# EAGLE schematic rotary_breakout (EAGLE 9.2.0)
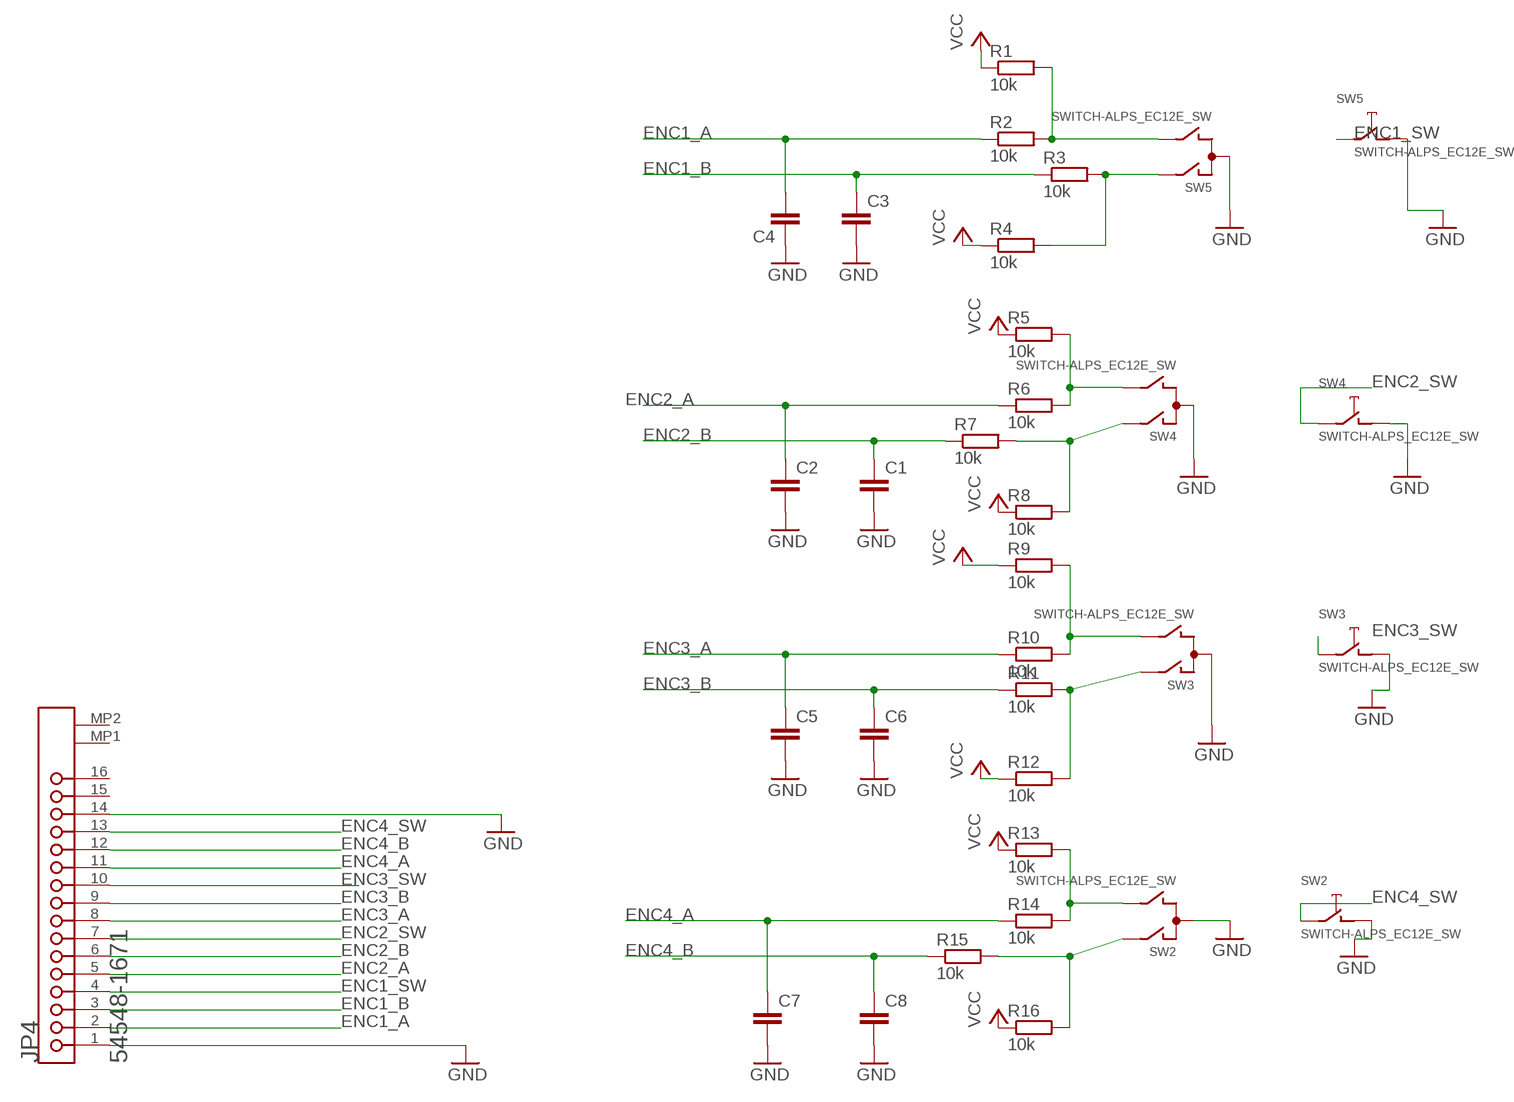
[diagram p0: schematic, sheet 1]

## Parts
C1  C-EUC0805  [C0805]
C2  C-EUC0805  [C0805]
C3  C-EUC0805  [C0805]
C4  C-EUC0805  [C0805]
C5  C-EUC0805  [C0805]
C6  C-EUC0805  [C0805]
C7  C-EUC0805  [C0805]
C8  C-EUC0805  [C0805]
JP4  MOLEX_54548-1671MOLEX_54548-1671_0_0  [MOLEX_54548-1671_0]
R1  10k  R-EU_R0603  [R0603]
R2  10k  R-EU_R0603  [R0603]
R3  10k  R-EU_R0603  [R0603]
R4  10k  R-EU_R0603  [R0603]
R5  10k  R-EU_R0603  [R0603]
R6  10k  R-EU_R0603  [R0603]
R7  10k  R-EU_R0603  [R0603]
R8  10k  R-EU_R0603  [R0603]
R9  10k  R-EU_R0603  [R0603]
R10  10k  R-EU_R0603  [R0603]
R11  10k  R-EU_R0603  [R0603]
R12  10k  R-EU_R0603  [R0603]
R13  10k  R-EU_R0603  [R0603]
R14  10k  R-EU_R0603  [R0603]
R15  10k  R-EU_R0603  [R0603]
R16  10k  R-EU_R0603  [R0603]
SW2  SWITCH-ALPS_EC12E_SW  [SWITCH-ALPS_ALPS_EC12E_SW]
SW3  SWITCH-ALPS_EC12E_SW  [SWITCH-ALPS_ALPS_EC12E_SW]
SW4  SWITCH-ALPS_EC12E_SW  [SWITCH-ALPS_ALPS_EC12E_SW]
SW5  SWITCH-ALPS_EC12E_SW  [SWITCH-ALPS_ALPS_EC12E_SW]

## Nets
ENC1_A: C4.2 JP4.2 R2.1
ENC1_B: C3.1 JP4.3 R3.1
ENC1_SW: JP4.4 SW5.E
ENC2_A: C2.1 JP4.5 R6.1
ENC2_B: C1.1 JP4.6 R7.1
ENC2_SW: JP4.7 SW4.E
ENC3_A: C5.1 JP4.8 R10.1
ENC3_B: C6.1 JP4.9 R11.1
ENC3_SW: JP4.10 SW3.E
ENC4_A: C7.1 JP4.11 R14.1
ENC4_B: C8.1 JP4.12 R15.1
ENC4_SW: JP4.13 SW2.E
GND: C1.2 C2.2 C3.2 C4.1 C5.2 C6.2 C7.2 C8.2 JP4.1 JP4.14 SW2.C SW2.D SW3.C SW3.D SW4.C SW4.D SW5.C SW5.D
N$1: R1.2 R2.2 SW5.B
N$2: R5.2 R6.2 SW4.B
N$3: R9.2 R10.2 SW3.B
N$4: R13.2 R14.2 SW2.B
N$5: R7.2 R8.2 SW4.A
N$6: R11.2 R12.2 SW3.A
N$7: R15.2 R16.2 SW2.A
N$8: R3.2 R4.2 SW5.A
VCC: R1.1 R4.1 R5.1 R8.1 R9.1 R12.1 R13.1 R16.1
Unconnected: JP4.15 JP4.16 JP4.MP1 JP4.MP2 SW2.GND1(G) SW2.GND2(G) SW3.GND1(G) SW3.GND2(G) SW4.GND1(G) SW4.GND2(G) SW5.GND1(G) SW5.GND2(G)

## Library data of the parts
C1-C8 = resistor-nick:C-EU: CAPACITOR, European symbol
JP4 = Molex - 54548-1671:MOLEX_54548-1671: MOLX-54548-1671; CIIVA_IDS: 3405222; CIRCUITS_LOADED: 16; COMPONENT_LINK_1_DESCRIPTION: Manufacturer URL; COMPONENT_LINK_1_URL: http://www.molex.com/molex/index.jsp; COMPONENT_LINK_3_DESCRIPTION: Package Specification; COMPONENT_LINK_3_URL: http://www.molex.com/pdm_docs/sd/545481671_sd.pdf; CONTACT_POSITION: Bottom; CURRENT_MAX_PER_CONTACT: 0.5A; DATASHEET: http://www.molex.com/webdocs/datasheets/pdf/en-us/0545481671_FFC_FPC_CONNECTORS.pdf; DURABILITY_MATING_CYCLES_MAX: 20; ENTRY_ANGLE: 90degrees Angle; FOOTPRINT_VARIANT_NAME_0: Manufacturer Recommended; IMPORTED: yes; IMPORTED_FROM: vault; IMPORT_TS: 1521842126; MATED_HEIGHT: 1.20mm; MATERIAL___METAL: Phosphor Bronze; MATERIAL___PLATING_MATING: Gold; MATERIAL___PLATING_TERMINATION: Tin; MF: Molex; MOUNTING_TECHNOLOGY: Surface Mount; MPN: 54548-1671; NUMBER_OF_ROWS: 1; ORIENTATION: Right Angle; PACKAGE: 54548-1671; PACKAGE_DESCRIPTION: 16-Lead FPC Connector, Pitch 0.5 mm; PACKAGE_VERSION: Rev. N, 06/2008; PACKING: Tape and Reel; PCB_LOCATOR: No; PCB_RETENTION: Yes; PITCH___MATING_INTERFACE: 0.50mm; POLARIZED_TO_PCB: Yes; PREFIX: J; RELEASE_DATE: 1411372732; ROHS: Yes; STACKABLE: No; VAULT_GUID: 6073BA2D-1C54-4637-B0CB-3A1C5E03E9B0; VAULT_REVISION: ECAF290E-3206-450B-9A7D-DEE08DAAC15F; VOLTAGE_MAX: 50V
R1-R16 = resistor-nick:R-EU_: RESISTOR, European symbol
SW2-SW5 = interface:SWITCH-ALPS_EC12E_SW: ALPS rotary Encoder EC12E series with switch; MPN: EC12E2424407; OC_FARNELL: 1520813; OC_NEWARK: 74M1068

## Net classes
1 PWR: width 0.457 mm, clearance 0.203 mm